# Altium schematic sheet Peripheralls_and_power_Supply.SchDoc
size A3; SheetNumber: 3; SheetTotal: 3
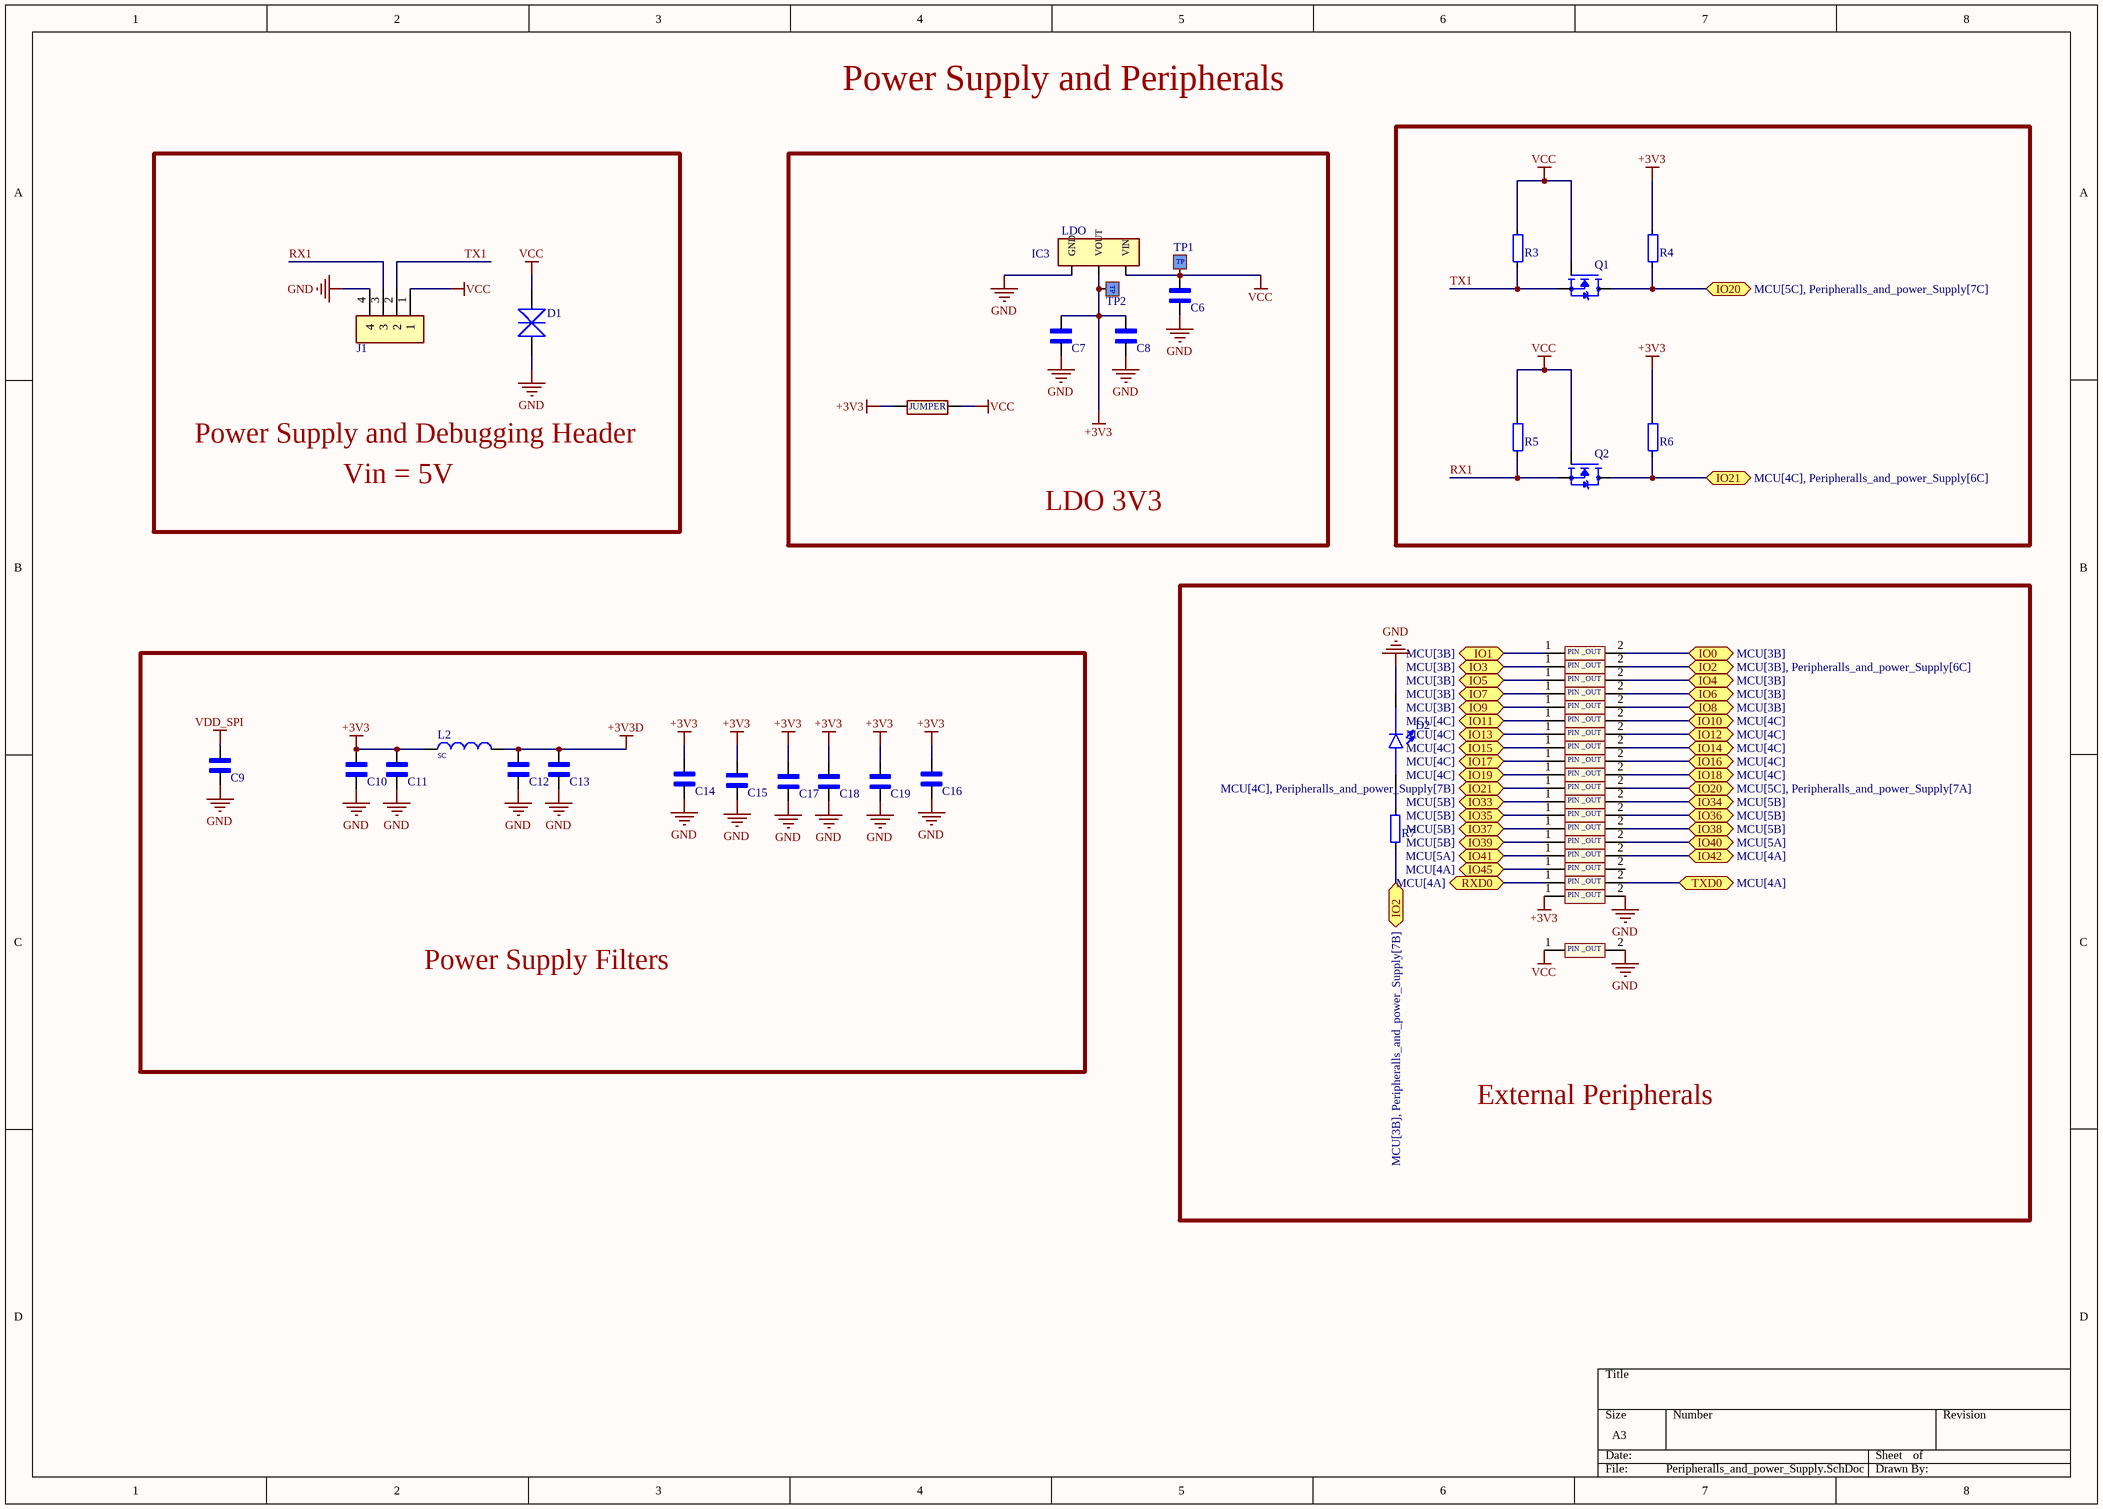
[diagram p0: Peripheralls_and_power_Supply.SchDoc]

## Parts
C6  CAP_0603  [CAP_0603]  (value not drawn)
C7  CAP_0603  [CAP_0603]  (value not drawn)
C8  CAP_0603  [CAP_0603]  (value not drawn)
C9  CAP_0603  [CAP_0603]  (value not drawn)
C10  CAP_0603  [CAP_0603]  (value not drawn)
C11  CAP_0603  [CAP_0603]  (value not drawn)
C12  CAP_0603  [CAP_0603]  (value not drawn)
C13  CAP_0603  [CAP_0603]  (value not drawn)
C14  CAP_0603  [CAP_0603]  (value not drawn)
C15  CAP_0603  [CAP_0603]  (value not drawn)
C16  CAP_0603  [CAP_0603]  (value not drawn)
C17  CAP_0603  [CAP_0603]  (value not drawn)
C18  CAP_0603  [CAP_0603]  (value not drawn)
C19  CAP_0603  [CAP_0603]  (value not drawn)
D1  TVS_DIODE_3.6V  [ESD_DIODE]  (value not drawn)
D2  LED0603  [LED0603]  (value not drawn)
IC3  LDO  [AMS1117]
J1  S4B-PH-SM4-TB_LF__SN_  [S4B-PH-SM4-TB]  (value not drawn)
JU1  JUMER  [JUMPER]  (value not drawn)
L2  value SC  [IND_0402]  (hidden comment: IND_0402)
P1  PIN OUT  [PIN_OUT]  (value not drawn)
P2  PIN OUT  [PIN_OUT]  (value not drawn)
P3  PIN OUT  [PIN_OUT]  (value not drawn)
P4  PIN OUT  [PIN_OUT]  (value not drawn)
P5  PIN OUT  [PIN_OUT]  (value not drawn)
P6  PIN OUT  [PIN_OUT]  (value not drawn)
P7  PIN OUT  [PIN_OUT]  (value not drawn)
P8  PIN OUT  [PIN_OUT]  (value not drawn)
P9  PIN OUT  [PIN_OUT]  (value not drawn)
P10  PIN OUT  [PIN_OUT]  (value not drawn)
P11  PIN OUT  [PIN_OUT]  (value not drawn)
P12  PIN OUT  [PIN_OUT]  (value not drawn)
P13  PIN OUT  [PIN_OUT]  (value not drawn)
P14  PIN OUT  [PIN_OUT]  (value not drawn)
P15  PIN OUT  [PIN_OUT]  (value not drawn)
P16  PIN OUT  [PIN_OUT]  (value not drawn)
P17  PIN OUT  [PIN_OUT]  (value not drawn)
P18  PIN OUT  [PIN_OUT]  (value not drawn)
P19  PIN OUT  [PIN_OUT]  (value not drawn)
P20  PIN OUT  [PIN_OUT]  (value not drawn)
Q1  LOGIC SHIFTER MOSFET  [BSS138_SOT-23-3 (TO-236)]  (value not drawn)
Q2  LOGIC SHIFTER MOSFET  [BSS138_SOT-23-3 (TO-236)]  (value not drawn)
R3  RES_0603  [RES_0603]  (value not drawn)
R4  RES_0603  [RES_0603]  (value not drawn)
R5  RES_0603  [RES_0603]  (value not drawn)
R6  RES_0603  [RES_0603]  (value not drawn)
R7  RES_0603  [RES_0603]  (value not drawn)
TP1  TP  [PCBComponent_1]  (value not drawn)
TP2  TP  [PCBComponent_1]  (value not drawn)

## Blocks framed on the sheet
LDO 3V3: C6-C8 IC3 JU1 TP1 TP2
External Peripherals: D2 P1-P20 R7
Power Supply Filters: C9-C19 L2

## Ports
IO0 (bidir, see MCU[3B]), IO1 (bidir, see MCU[3B]), IO2 (bidir, see MCU[3B], Peripheralls_and_power_Supply[6C]), IO2 (bidir, see MCU[3B], Peripheralls_and_power_Supply[7B]), IO3 (bidir, see MCU[3B]), IO4 (bidir, see MCU[3B]), IO5 (bidir, see MCU[3B]), IO6 (bidir, see MCU[3B]), IO7 (bidir, see MCU[3B]), IO8 (bidir, see MCU[3B]), IO9 (bidir, see MCU[3B]), IO10 (bidir, see MCU[4C]), IO11 (bidir, see MCU[4C]), IO12 (bidir, see MCU[4C]), IO13 (bidir, see MCU[4C]), IO14 (bidir, see MCU[4C]), IO15 (bidir, see MCU[4C]), IO16 (bidir, see MCU[4C]), IO17 (bidir, see MCU[4C]), IO18 (bidir, see MCU[4C]), IO19 (bidir, see MCU[4C]), IO20 (bidir, see MCU[5C], Peripheralls_and_power_Supply[7A]), IO20 (bidir, see MCU[5C], Peripheralls_and_power_Supply[7C]), IO21 (bidir, see MCU[4C], Peripheralls_and_power_Supply[6C]), IO21 (bidir, see MCU[4C], Peripheralls_and_power_Supply[7B]), IO33 (bidir, see MCU[5B]), IO34 (bidir, see MCU[5B]), IO35 (bidir, see MCU[5B]), IO36 (bidir, see MCU[5B]), IO37 (bidir, see MCU[5B]), IO38 (bidir, see MCU[5B]), IO39 (bidir, see MCU[5B]), IO40 (bidir, see MCU[5A]), IO41 (bidir, see MCU[5A]), IO42 (bidir, see MCU[4A]), IO45 (bidir, see MCU[4A]), RXD0 (bidir, see MCU[4A]), TXD0 (bidir, see MCU[4A])

## Nets
+3V3: C7.1 C8.1 C10.2 C11.2 C14.2 C15.2 C16.2 C17.2 C18.2 C19.2 IC3.2(VOUT) JU1.1 L2.1 P19.1 R4.2 R6.2 TP2.1(T?)
+3V3D: C12.2 C13.2 L2.2
GND: C6.1 C7.2 C8.2 C9.1 C10.1 C11.1 C12.1 C13.1 C14.1 C15.1 C16.1 C17.1 C18.1 C19.1 D1.2 D2.C IC3.1(GND) J1.4 P19.2 P20.2
VCC: C6.2 D1.1 IC3.3(VIN) J1.1 JU1.2 P20.1 Q1.1(G) Q2.1(G) R3.2 R5.2 TP1.1(T?)
VDD_SPI: C9.2
IO0: P1.2 ; port IO0
IO1: P1.1 ; port IO1
IO2: P2.2 R7.2 ; port IO2
IO3: P2.1 ; port IO3
IO4: P3.2 ; port IO4
IO5: P3.1 ; port IO5
IO6: P4.2 ; port IO6
IO7: P4.1 ; port IO7
IO8: P5.2 ; port IO8
IO9: P5.1 ; port IO9
IO10: P6.2 ; port IO10
IO11: P6.1 ; port IO11
IO12: P7.2 ; port IO12
IO13: P7.1 ; port IO13
IO14: P8.2 ; port IO14
IO15: P8.1 ; port IO15
IO16: P9.2 ; port IO16
IO17: P9.1 ; port IO17
IO18: P10.2 ; port IO18
IO19: P10.1 ; port IO19
IO20: P11.2 Q1.3(D) R4.1 ; port IO20
IO21: P11.1 Q2.3(D) R6.1 ; port IO21
IO33: P12.1 ; port IO33
IO34: P12.2 ; port IO34
IO35: P13.1 ; port IO35
IO36: P13.2 ; port IO36
IO37: P14.1 ; port IO37
IO38: P14.2 ; port IO38
IO39: P15.1 ; port IO39
IO40: P15.2 ; port IO40
IO41: P16.1 ; port IO41
IO42: P16.2 ; port IO42
IO45: P17.1 ; port IO45
RX1: J1.3 Q2.2(S) R5.1
RXD0: P18.1 ; port RXD0
TX1: J1.2 Q1.2(S) R3.1
TXD0: P18.2 ; port TXD0
NetD2_A: D2.A R7.1

Not connected (* = marked no-connect by the designer): P17 2

## Notes on the sheet
- Power Supply and Peripherals
- Power Supply and Debugging Header
- Vin = 5V
- (in symbol PIN OUT) PIN _OUT

## Library data of the parts
D2 = LED0603: White LED Indication - Discrete 2.93V 0603 (1608 Metric); MF: Lite-On Inc.; MP: LTW-C191TS5; Price: None; Check_prices: https://www.snapeda.com/parts/LTW-C191TS5/Lite-On%20Inc./view-part/46909/?ref=eda; SnapEDA_Link: https://www.snapeda.com/parts/LTW-C191TS5/Lite-On%20Inc./view-part/46909/?ref=snap; Package: 0603 Lite-On; Purchase-URL: https://pricing.snapeda.com/search/part/LTW-C191TS5/?ref=eda; Availability: Warning; Value: *
IC3 = AMS1117-3.3: Integrated Circuit; Manufacturer_Name: Advanced; Datasheet Link: https://datasheet.datasheetarchive.com/originals/distributors/Datasheets-28/DSA-550594.pdf; Height: 1.8mm; Manufacturer_Part_Number: AMS1117-3.3
J1 = S4B-PH-SM4-TB_LF__SN_: Connector; Manufacturer_Name: JST (JAPAN SOLDERLESS TERMINALS); Manufacturer_Part_Number: S4B-PH-SM4-TB(LF)(SN); Datasheet Link: http://uk.rs-online.com/web/p/products/6881366; Arrow Part Number: S4B-PH-SM4-TB(LF)(SN); Arrow Price/Stock: https://www.arrow.com/en/products/s4b-ph-sm4-tb-lf-sn/jst-manufacturing?region=europe
JU1 = JUMPER: RES_0603; Value: *
L2 = IND_2.0nH_0402: Inductor RF Chip Multi-Layer 2nH 0.3nH 100MHz 8Q-Factor Air 900mA 90mOhm DCR 0402 Automotive T/R; MP: LQG15HZ2N0S02D; Package: None; Price: None; Availability: Unavailable
Q1 Q2 = BSS138: N-Channel 50V 220mA (Ta) 360mW (Ta) Surface Mount SOT-23-3; Price: None; MP: BSS138; Value: *; Availability: Unavailable; Package: None
C6-C19 = CAP_0603: Package: 1608 AVX